# Altium schematic sheet SOC_SOUND.schdoc: =
size A4; Symbol: Sheet-Symbol_A4; Company: 嘉立创EDA; Version: V1.0; Page Size: A4; @Project Name: RK3568B2地瓜派; @Page Count: 27; @Update Date: 2025-09-11; @Create Date: 2025-09-11; @Schematic Name: Schematic1; @Page No: 13; @Page Name: SOC_SOUND; Device: Sheet-Symbol_A4; Border: 1; Title Block Position: 3; Width: 1170; Height: 825; Region Start: 1; X Region Count: 6; Y Region Count: 4; Blade Width: 10; @Board Name: Board1; @Create Time: 22:14:45; @Update Time: 22:15:05; Organization: ORGANIZATION; Address1: ADDRESS 1; Address2: ADDRESS 2; Address3: ADDRESS 3; Address4: ADDRESS 4; SheetNumber: 16; SheetTotal: 28
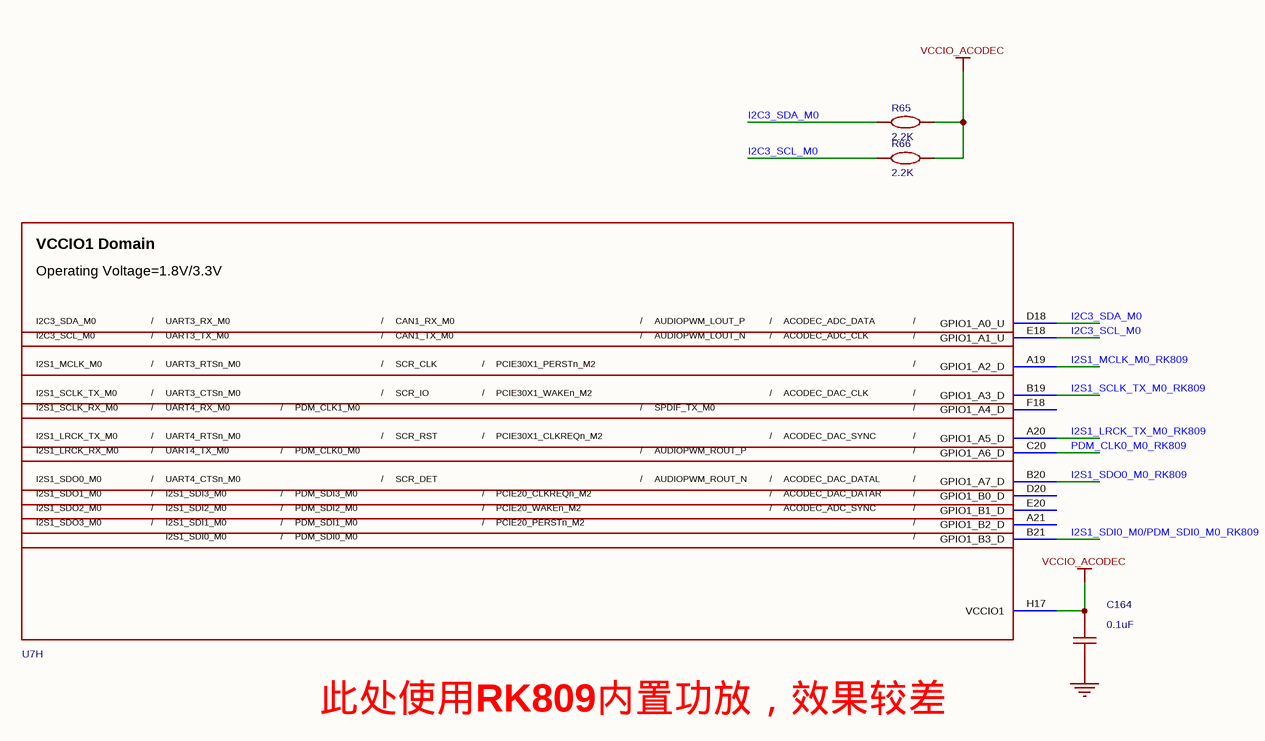
[diagram p0: SOC_SOUND.schdoc]

## Parts
C164  0.1uF  [C0201]
R65  2.2K  [R0402]
R66  2.2K  [R0402]
U7  RK3568  [BGA-636_L19.0-W19.0-P0.65-BL]  (value not drawn)  (part H of 23)

## Nets
GND: C164.1
VCCIO_ACODEC: C164.2 R65.2 R66.2 U7.H17(VCCIO1)
I2C3_SCL_M0: R66.1 U7.E18(GPIO1_A1_U)
I2C3_SDA_M0: R65.1 U7.D18(GPIO1_A0_U)
I2S1_LRCK_TX_M0_RK809: U7.A20(GPIO1_A5_D)
I2S1_MCLK_M0_RK809: U7.A19(GPIO1_A2_D)
I2S1_SCLK_TX_M0_RK809: U7.B19(GPIO1_A3_D)
I2S1_SDI0_M0/PDM_SDI0_M0_RK809: U7.B21(GPIO1_B3_D)
I2S1_SDO0_M0_RK809: U7.B20(GPIO1_A7_D)
PDM_CLK0_M0_RK809: U7.C20(GPIO1_A6_D)

Not connected (* = marked no-connect by the designer): U7 A21(GPIO1_B2_D) D20(GPIO1_B0_D) E20(GPIO1_B1_D) F18(GPIO1_A4_D)

## Notes on the sheet
- 此处使用RK809内置功放，效果较差
- Drawn By :
- Checked By :
- Approved By :
- SheetNumber
- SheetTotal
- Revision :
- Time :
- Size :
- Date :
- A4
- DocumentName :
- Project :
- (in symbol RK3568, part H) VCCIO1 Domain; Operating Voltage=1.8V/3.3V; I2C3_SDA_M0; /; UART3_RX_M0; CAN1_RX_M0; AUDIOPWM_LOUT_P; ACODEC_ADC_DATA; I2C3_SCL_M0; UART3_TX_M0; CAN1_TX_M0; AUDIOPWM_LOUT_N; ACODEC_ADC_CLK; I2S1_MCLK_M0; UART3_RTSn_M0; SCR_CLK; PCIE30X1_PERSTn_M2; I2S1_SCLK_TX_M0; UART3_CTSn_M0; SCR_IO; PCIE30X1_WAKEn_M2; ACODEC_DAC_CLK; I2S1_SCLK_RX_M0; UART4_RX_M0; PDM_CLK1_M0; SPDIF_TX_M0; I2S1_LRCK_TX_M0; UART4_RTSn_M0; SCR_RST; PCIE30X1_CLKREQn_M2; ACODEC_DAC_SYNC; I2S1_LRCK_RX_M0; UART4_TX_M0; PDM_CLK0_M0; AUDIOPWM_ROUT_P; I2S1_SDO0_M0; UART4_CTSn_M0; SCR_DET; AUDIOPWM_ROUT_N; ACODEC_DAC_DATAL; I2S1_SDO1_M0; I2S1_SDI3_M0; PDM_SDI3_M0; PCIE20_CLKREQn_M2; ACODEC_DAC_DATAR; I2S1_SDO2_M0; I2S1_SDI2_M0; PDM_SDI2_M0; PCIE20_WAKEn_M2; ACODEC_ADC_SYNC; I2S1_SDO3_M0; I2S1_SDI1_M0; PDM_SDI1_M0; PCIE20_PERSTn_M2; I2S1_SDI0_M0; PDM_SDI0_M0

## Library data of the parts
C164 = GRM035R60J475ME15D: 容值:4.7uF;精度:±20%;额定电压:6.3V;温度系数:X5R;; Manufacturer: muRata(村田); AddInBom: yes; ModelId: e8033a7cb35143ffb28e3b81b2577ea0; ModelName: C0201_L0.6-W0.3-H0.3; ModelTransform: 23.622,11.811,0,0,0,0,0,0,0; Tolerance: ±20%; Voltage Rating: 6.3V; Temperature Coefficient: X5R; Symbol: GRM035R60J475ME15D; Value: 0.1uF; Device: GRM035R60J475ME15D; LCSC Part Name: 4.7uF ±20% 6.3V; ManufacturerPart: GRM035R60J475ME15D; Supplier Footprint: 0201; JLCPCB Part Class: Extended Part; Datasheet: https://item.szlcsc.com/datasheet/GRM035R60J475ME15D/313624.html; Supplier: LCSC; ConvertToPcb: yes; FootprintName: C0201
R65 R66 = Res_0402: Symbol: 电阻; 3D Model: 671aefced39d4c318694bba8bd8efd39; 3D Model Transform: 39.37,19.685,0,0,0,0,0,0.0005,0; ConvertToPcb: yes; ModelName: R0402_L1.0-W0.5-H0.5; Device: Res_0402; Supplier Footprint: 0402; Value: 2.2K; AddInBom: yes; FootprintName: R0402
U7 = RK3568: ConvertToPcb: yes; ModelId: e6756cba1b9f43448429fdcd1d44d9d9; ModelTransform: 748.03,748.03,54.33,0,0,0,0,0,0; Symbol: RK3568; Device: RK3568; AddInBom: yes; FootprintName: BGA-636_L19.0-W19.0-P0.65-BL; ModelName: BGA-636_L19.0-W19.0-P0.65-BL